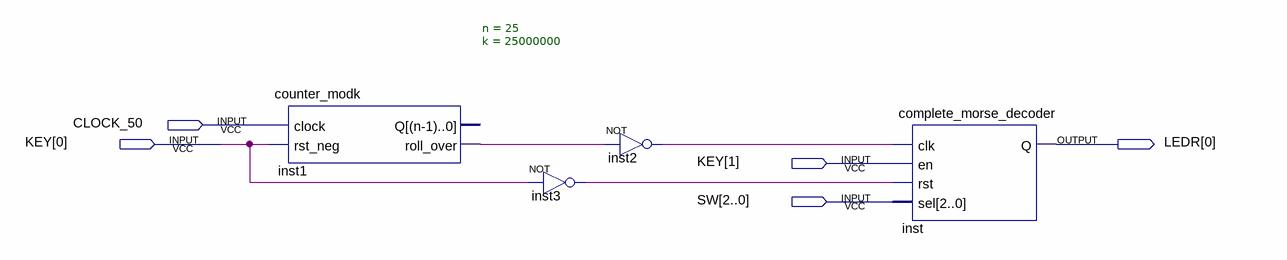
[diagram p0: schematic sheet]
// Quartus schematic Lab7Part4_Tested.bdf as structural Verilog: 4 symbols, 5 pins
module Lab7Part4_Tested (
  input  CLOCK_50,
  input  [1:0] KEY,
  input  [2:0] SW,
  output [0:0] LEDR
);

  wire inst1_roll_over, inst2_out, inst3_out;

  counter_modk #(.n(25), .k(25000000)) inst1 (
    .clock(CLOCK_50), .rst_neg(KEY[0]), .roll_over(inst1_roll_over));  // open: Q
  not inst3 (inst3_out, KEY[0]);
  not inst2 (inst2_out, inst1_roll_over);
  complete_morse_decoder inst (.clk(inst2_out), .en(KEY[1]), .rst(inst3_out), .sel(SW), .Q(LEDR[0]));
endmodule
